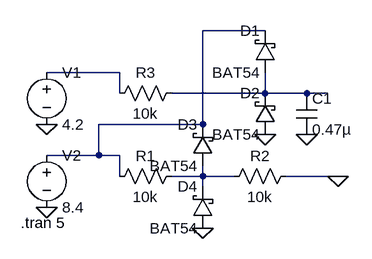
[diagram p0: schematic Clamp_Sim.asc]
Clamp_Sim.asc, the LTspice schematic file:
Version 4
SHEET 1 880 680
WIRE 400 32 304 32
WIRE 176 96 64 96
WIRE 176 128 176 96
WIRE 400 128 400 96
WIRE 400 128 256 128
WIRE 464 128 400 128
WIRE 496 128 464 128
WIRE 304 176 304 32
WIRE 304 176 144 176
WIRE 144 224 144 176
WIRE 144 224 64 224
WIRE 176 224 144 224
WIRE 176 256 176 224
WIRE 304 256 304 240
WIRE 304 256 256 256
WIRE 352 256 304 256
WIRE 512 256 432 256
WIRE 528 256 512 256
WIRE 304 272 304 256
FLAG 64 304 0
FLAG 64 176 0
FLAG 400 192 0
FLAG 304 336 0
FLAG 512 256 0
FLAG 464 192 0
SYMBOL voltage 64 80 R0
WINDOW 123 0 0 Left 0
WINDOW 39 0 0 Left 0
SYMATTR InstName V1
SYMATTR Value 4.2
SYMBOL voltage 64 208 R0
WINDOW 123 0 0 Left 0
WINDOW 39 0 0 Left 0
SYMATTR InstName V2
SYMATTR Value 8.4
SYMBOL res 272 240 R90
WINDOW 0 0 56 VBottom 2
WINDOW 3 32 56 VTop 2
SYMATTR InstName R1
SYMATTR Value 10k
SYMBOL res 448 240 R90
WINDOW 0 0 56 VBottom 2
WINDOW 3 32 56 VTop 2
SYMATTR InstName R2
SYMATTR Value 10k
SYMBOL res 272 112 R90
WINDOW 0 0 56 VBottom 2
WINDOW 3 32 56 VTop 2
SYMATTR InstName R3
SYMATTR Value 10k
SYMBOL schottky 416 96 R180
WINDOW 0 24 64 Left 2
WINDOW 3 24 0 Left 2
SYMATTR InstName D1
SYMATTR Value BAT54
SYMBOL schottky 416 192 R180
WINDOW 0 24 64 Left 2
WINDOW 3 24 0 Left 2
SYMATTR InstName D2
SYMATTR Value BAT54
SYMBOL schottky 320 240 R180
WINDOW 0 24 64 Left 2
WINDOW 3 24 0 Left 2
SYMATTR InstName D3
SYMATTR Value BAT54
SYMBOL schottky 320 336 R180
WINDOW 0 24 64 Left 2
WINDOW 3 24 0 Left 2
SYMATTR InstName D4
SYMATTR Value BAT54
SYMBOL cap 448 128 R0
SYMATTR InstName C1
SYMATTR Value 0.47µ
TEXT 24 328 Left 2 !.tran 5

The netlist it stands for:
* Clamp_Sim.asc
V1 N002 0 4.2
V2 N001 0 8.4
R1 N004 N001 10k
R2 0 N004 10k
R3 N003 N002 10k
D1 N003 N001 BAT54
D2 0 N003 BAT54
D3 N004 N001 BAT54
D4 0 N004 BAT54
C1 N003 0 0.47µ
.model D D
.lib standard.dio
.tran 5
.backanno
.end